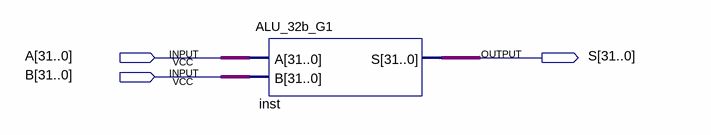
[diagram p0: schematic sheet]
// Quartus schematic ALU32TEST.bdf as structural Verilog: 1 symbols, 3 pins
module ALU32TEST (
  input  [31:0] A,
  input  [31:0] B,
  output [31:0] S
);

  ALU_32b_G1 inst (.A(A), .B(B), .S(S));
endmodule
